# EAGLE design QuadroMIDI (EAGLE 6.6.0)
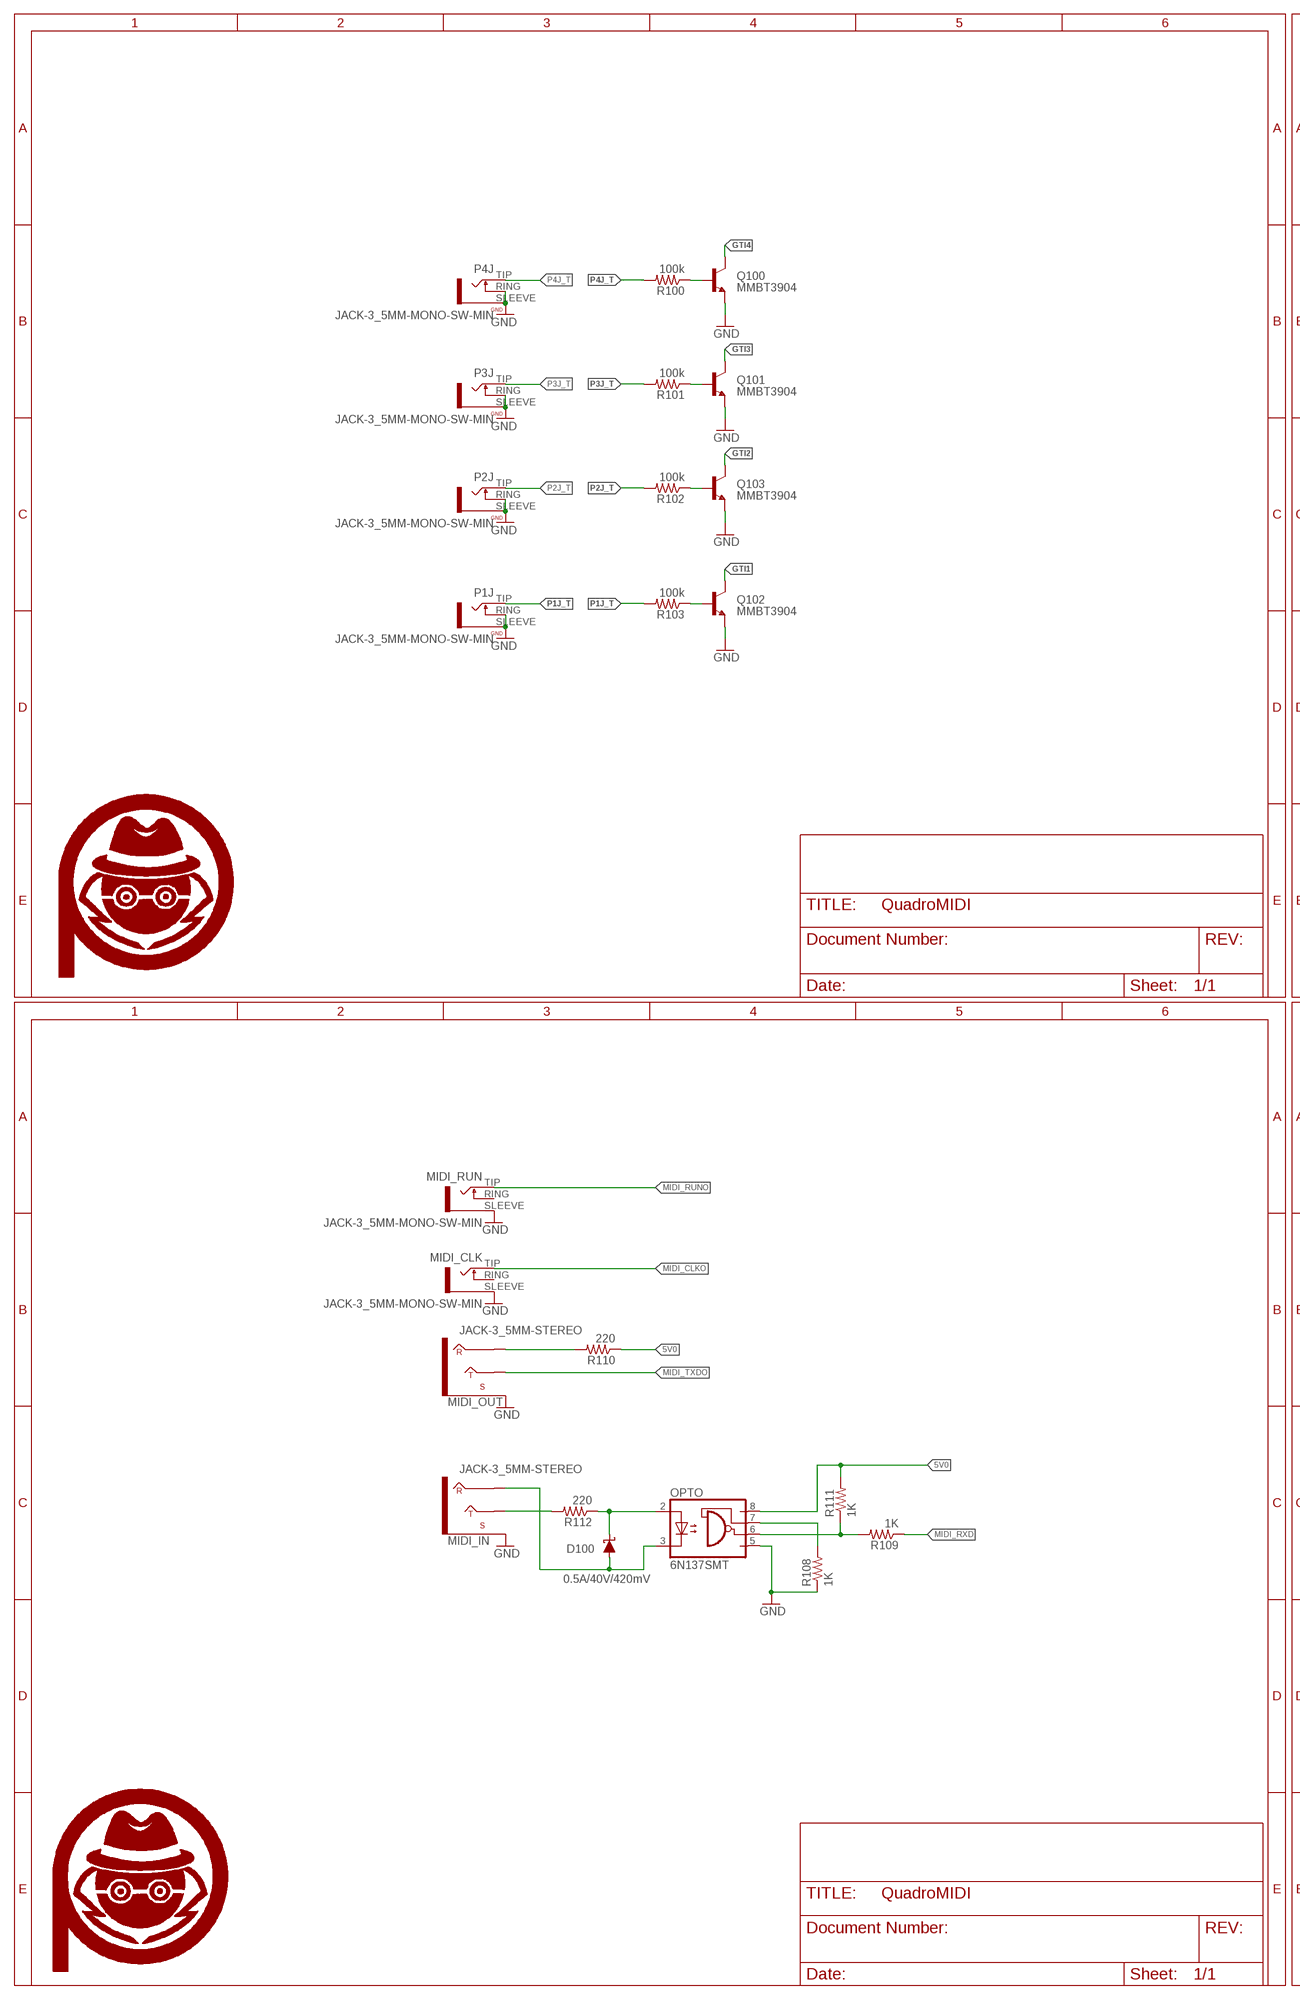
[diagram p0: schematic, sheet 1, part 1 of 2]
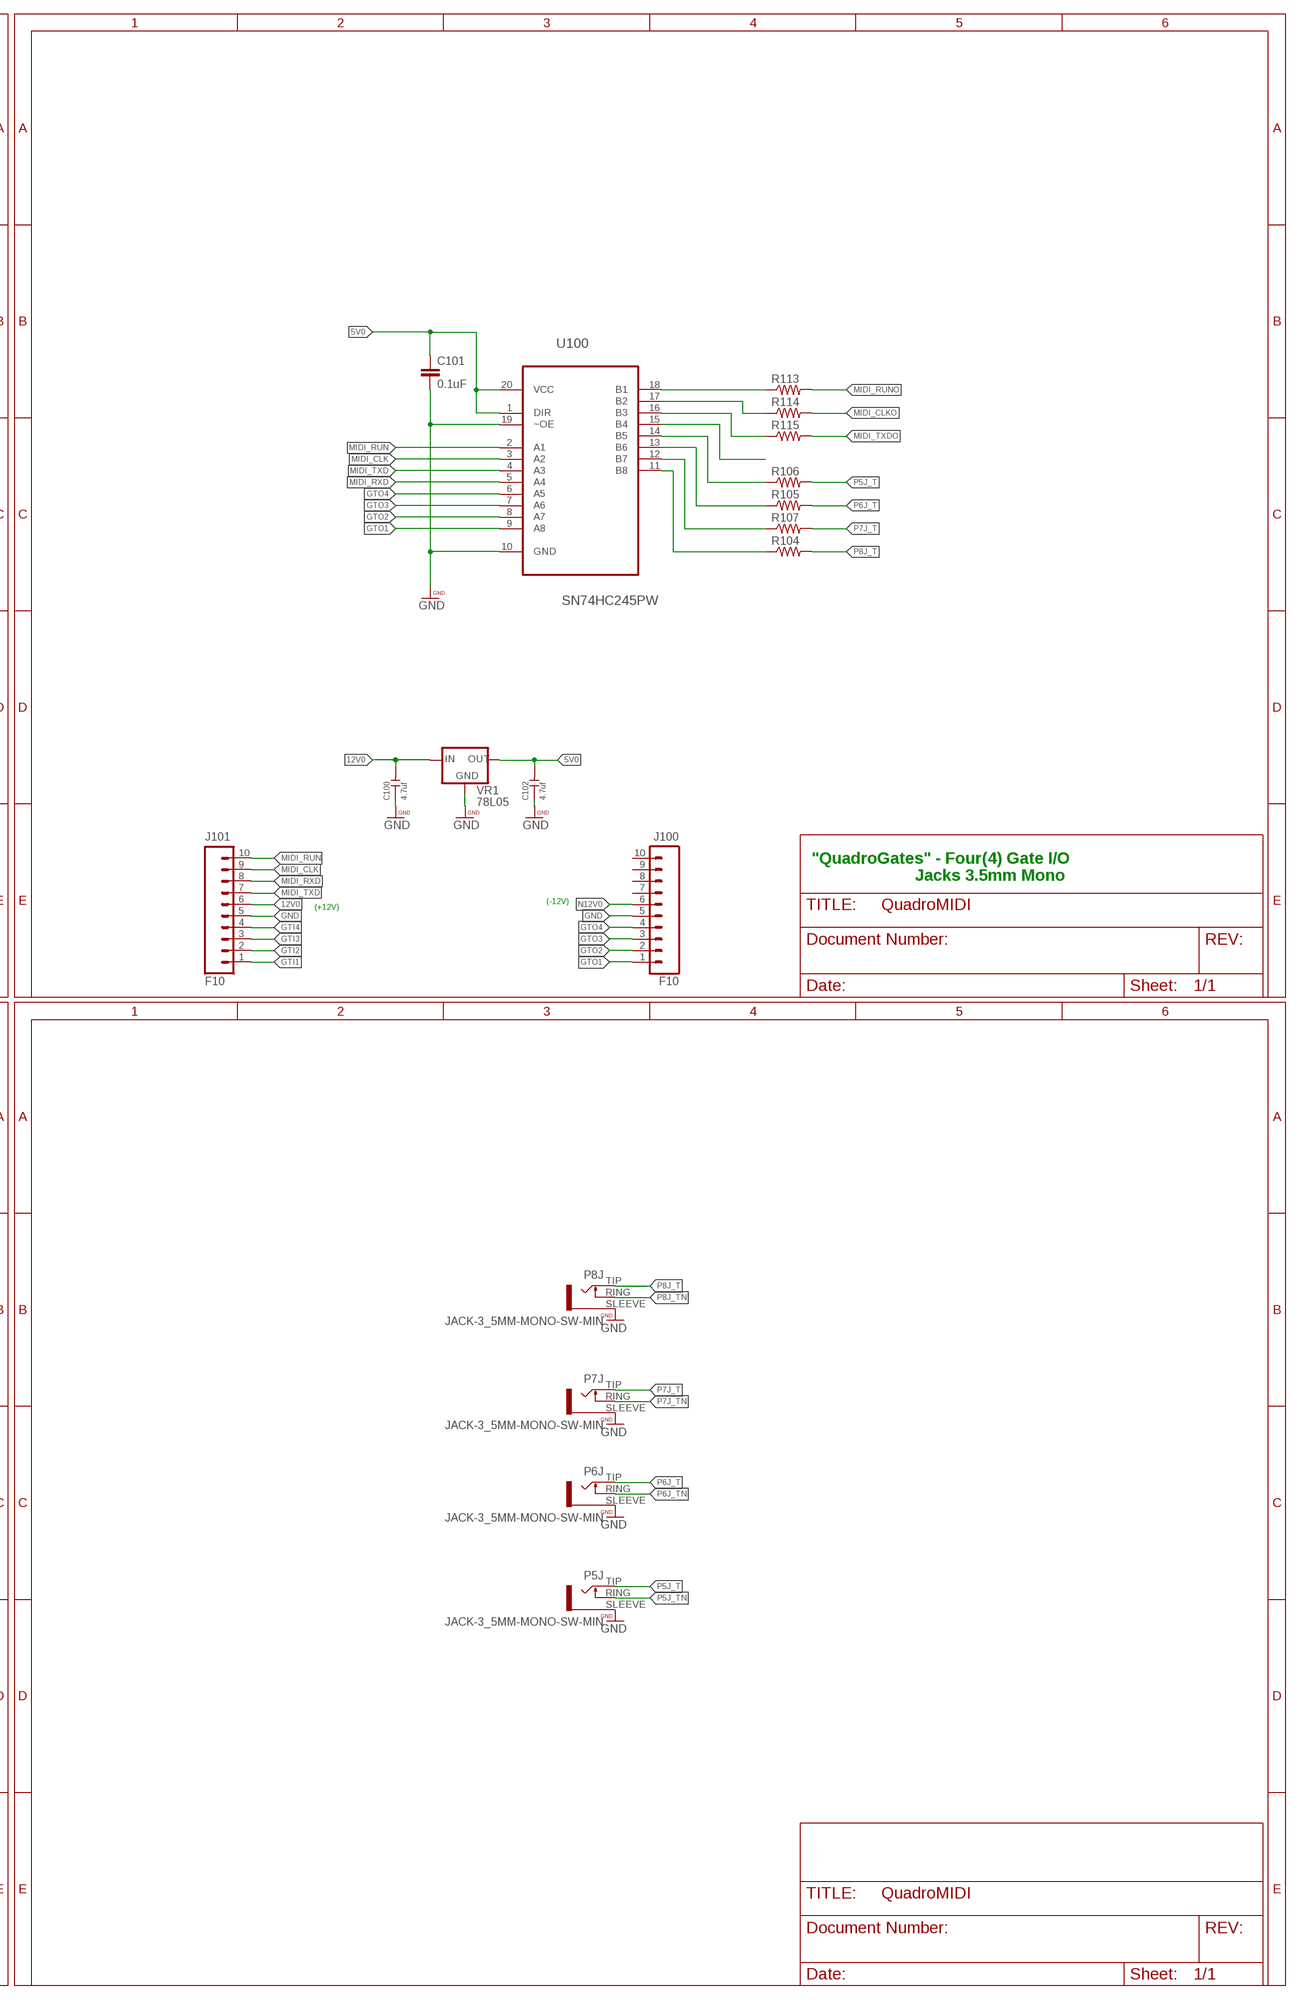
[diagram p1: schematic, sheet 1, part 2 of 2]

## Parts
$$U$1  PA_LOGO_SYMLARGE  [PA_LOGO_AGENT_LRG_SYM]
C100  4.7uf  CERAMIC-4.7UF-25V-10%-X5R(0805)  [C0805]
C101  0.1uF  CAP0603-CAP  [0603-CAP]
C102  4.7uf  CERAMIC-4.7UF-25V-10%-X5R(0805)  [C0805]
D100  0.5A/40V/420mV  DIODE-SCHOTTKY-PMEG4005EJ  [SOD-323]
J100  F10  M10SILK_FEMALE_PTH  [1X10_OCTO]
J101  F10  M10SILK_FEMALE_PTH  [1X10_OCTO]
MIDI_CLK  JACK-3_5MM-MONO-SW-MIN  [WQP_PJ301M-MIN]
MIDI_IN  JACK-3_5MM-STEREO  [WQP_PJ301M-MIN]
MIDI_OUT  JACK-3_5MM-STEREO  [WQP_PJ301M-MIN]
MIDI_RUN  JACK-3_5MM-MONO-SW-MIN  [WQP_PJ301M-MIN]
OPTO  6N137SMT  [DIL8-SMD]
P1J  JACK-3_5MM-MONO-SW-MIN  [WQP_PJ301M-MIN]
P2J  JACK-3_5MM-MONO-SW-MIN  [WQP_PJ301M-MIN]
P3J  JACK-3_5MM-MONO-SW-MIN  [WQP_PJ301M-MIN]
P4J  JACK-3_5MM-MONO-SW-MIN  [WQP_PJ301M-MIN]
P5J  JACK-3_5MM-MONO-SW-MIN  [WQP_PJ301M-MIN]
P6J  JACK-3_5MM-MONO-SW-MIN  [WQP_PJ301M-MIN]
P7J  JACK-3_5MM-MONO-SW-MIN  [WQP_PJ301M-MIN]
P8J  JACK-3_5MM-MONO-SW-MIN  [WQP_PJ301M-MIN]
Q100  MMBT3904  MMBT3904LT1-NPN-SOT23-BEC  [SOT23-BEC]
Q101  MMBT3904  MMBT3904LT1-NPN-SOT23-BEC  [SOT23-BEC]
Q102  MMBT3904  MMBT3904LT1-NPN-SOT23-BEC  [SOT23-BEC]
Q103  MMBT3904  MMBT3904LT1-NPN-SOT23-BEC  [SOT23-BEC]
R100  100k  R-US_R0603  [R0603]
R101  100k  R-US_R0603  [R0603]
R102  100k  R-US_R0603  [R0603]
R103  100k  R-US_R0603  [R0603]
R104  RESISTOR0603-RES  [0603-RES]
R105  RESISTOR0603-RES  [0603-RES]
R106  RESISTOR0603-RES  [0603-RES]
R107  RESISTOR0603-RES  [0603-RES]
R108  1K  RESISTOR0603  [0603-RES]
R109  1K  RESISTOR0603  [0603-RES]
R110  220  RESISTOR0603  [0603-RES]
R111  1K  RESISTOR0603  [0603-RES]
R112  220  RESISTOR0603  [0603-RES]
R113  RESISTOR0603-RES  [0603-RES]
R114  RESISTOR0603-RES  [0603-RES]
R115  RESISTOR0603-RES  [0603-RES]
U100  SN74HC245PW  [SOP65P640X120-20N]
U$100  PA_LOGO_SYMSMALL  [PA_LOGO_AGENT_SMALL_SYM]
VR1  78L05  78LXX-SOT89  [SOT89]

## Nets
5V0: C101.1 C102.2 OPTO.8(VCC) R110.1 R111.2 U100.1(DIR) U100.20(VCC) VR1.1(OUT)
12V0: C100.2 J101.6 VR1.3(IN)
B1: R113.1 U100.18(B1)
B2: R114.1 U100.17(B2)
B3: R115.1 U100.16(B3)
B4: U100.15(B4)
B5: R106.1 U100.14(B5)
B6: R105.1 U100.13(B6)
B7: R107.1 U100.12(B7)
B8: R104.1 U100.11(B8)
GND: C100.1 C101.2 C102.1 J100.5 J101.5 MIDI_CLK.SLEEVE MIDI_IN.SLEEVE MIDI_OUT.SLEEVE MIDI_RUN.SLEEVE OPTO.5(GND) P1J.RING(TIP_SW) P1J.SLEEVE P2J.RING(TIP_SW) P2J.SLEEVE P3J.RING(TIP_SW) P3J.SLEEVE P4J.RING(TIP_SW) P4J.SLEEVE P5J.SLEEVE P6J.SLEEVE P7J.SLEEVE P8J.SLEEVE Q100.E Q101.E Q102.E Q103.E R108.1 U100.10(GND) U100.19(~OE) VR1.2(GND)
GTI1: J101.1 Q102.C
GTI2: J101.2 Q103.C
GTI3: J101.3 Q101.C
GTI4: J101.4 Q100.C
GTO1: J100.1 U100.9(A8)
GTO2: J100.2 U100.8(A7)
GTO3: J100.3 U100.7(A6)
GTO4: J100.4 U100.6(A5)
MIDI_CLK: J101.9 U100.3(A2)
MIDI_CLKO: MIDI_CLK.TIP R114.2
MIDI_RUN: J101.10 U100.2(A1)
MIDI_RUNO: MIDI_RUN.TIP R113.2
MIDI_RXD: J101.8 R109.1 U100.5(A4)
MIDI_TXD: J101.7 U100.4(A3)
MIDI_TXDO: MIDI_OUT.TIP R115.2
MIDIP: MIDI_IN.TIP R112.2
MIDIRX: OPTO.6(VO) R109.2 R111.1
MIDN: D100.A MIDI_IN.RING OPTO.3(C)
MIDP: D100.C OPTO.2(A) R112.1
N12V0: J100.6
N$1: Q102.B R103.1
N$2: Q103.B R102.1
N$3: MIDI_OUT.RING R110.2
N$4: Q101.B R101.1
N$5: Q100.B R100.1
OPTO: OPTO.7(VE) R108.2
P1J_T: P1J.TIP R103.2
P2J_T: P2J.TIP R102.2
P3J_T: P3J.TIP R101.2
P4J_T: P4J.TIP R100.2
P5J_T: P5J.TIP R106.2
P5J_TN: P5J.RING(TIP_SW)
P6J_T: P6J.TIP R105.2
P6J_TN: P6J.RING(TIP_SW)
P7J_T: P7J.TIP R107.2
P7J_TN: P7J.RING(TIP_SW)
P8J_T: P8J.TIP R104.2
P8J_TN: P8J.RING(TIP_SW)
Unconnected: J100.7 J100.8 J100.9 J100.10 MIDI_CLK.RING(TIP_SW) MIDI_RUN.RING(TIP_SW)

## Notes on the sheet
- "QuadroGates" - Four(4) Gate I/O
                         Jacks 3.5mm Mono
- (-12V)
- (+12V)

## Library data of the parts
$$U$1 U$100 = PatternAgents-Logos:PA_LOGO_SYM: PatternAgents Logo Symbol Trademark : PatternAgents, LLC Github : https://github.com/PatternAgents/PCB_Libraries License : http://creativecommons.org/licenses/by-sa/3.0/ (Creative Commons 3.0) THIS SOFTWARE IS PROVIDED BY THE CONTRIBUTORS "AS IS" AND WITHOUT ANY EXPRESS OR IMPLIED WARRANTIES, INCLUDING, BUT NOT LIMITED TO, THE IMPLIED WARRANTIES OF MERCHANTABILITY AND FITNESS FOR A PARTICULAR PURPOSE ARE DISCLAIMED. IN NO EVENT SHALL THE COPYRIGHT OWNER OR CONTRIBUTORS BE LIABLE FOR ANY DIRECT, INDIRECT, INCIDENTAL, SPECIAL, EXEMPLARY, OR CONSEQUENTIAL DAMAGES (INCLUDING, BUT NOT LIMITED TO, PROCUREMENT OF SUBSTITUTE GOODS OR SERVICES; LOSS OF USE, DATA, OR PROFITS; OR BUSINESS INTERRUPTION) HOWEVER CAUSED AND ON ANY THEORY OF LIABILITY, WHETHER IN CONTRACT, STRICT LIABILITY, OR TORT (INCLUDING NEGLIGENCE OR OTHERWISE) ARISING IN ANY WAY OUT OF THE USE OF THIS SOFTWARE, EVEN IF ADVISED OF THE POSSIBILITY OF SUCH DAMAGE.
C100 C102 = Seeed-Capacitor-2016:CERAMIC-4.7UF-25V-10%-X5R(0805): 302010146; MPN: CC0805KKX5R8BB475
C101 = PatternAgents-Misc:CAP: Capacitor Standard 0603 ceramic capacitor, and 0.1" leaded capacitor.
D100 = SparkFun-DiscreteSemi:DIODE-SCHOTTKY: Schottky diode A Schottky diode is a semiconductor diode which has a low forward voltage drop and a very fast switching action.; PROD_ID: DIO-10955
J100 J101 = oXo_Connectors:M10: Header 10 Standard 10-pin 0.1" header. Use with straight break away headers (SKU : PRT-00116), right angle break away headers (PRT-00553), swiss pins (PRT-00743), machine pins (PRT-00117), and female headers (PRT-00115).; PROD_ID: CONN-11563
MIDI_CLK MIDI_RUN P1J P2J P3J P4J P5J P6J P7J P8J = halcyonmod_Connectors:JACK-3_5MM-MONO-SW: Jack, 3.5mm, RIght Angle, Though-Hole
MIDI_IN MIDI_OUT = halcyonmod_Connectors:JACK-3_5MM-STEREO: Stereo 3.5mm Jack (TRS - Tip, Ring, Sleeve)
OPTO = og-optocouplers:6N137: MOTOROLA OPTO COUPLER
Q100-Q103 = transistor:*-NPN-: NPN Transistror BF959 corrected 2008.03.06
R100-R103 = rcl:R-US_: RESISTOR, American symbol
R104-R115 = PatternAgents-ProtoPads:RESISTOR: Resistor Basic schematic elements and footprints for 0603, 1206, and PTH resistors.
U100 = PatternAgents-TI:SN74HC245PW: OCTAL BUS TRANSCEIVERS; MPN: SN74HC245PW; OC_FARNELL: 1236221; OC_NEWARK: 13M5213; PACKAGE: TSSOP-20; SUPPLIER: Texas Instruments
VR1 = v-reg-3:78LXX: VOLTAGE REGULATOR

## Net classes
1 power: width 0.254 mm, drill 0.356 mm, clearance 0.178 mm

## Board
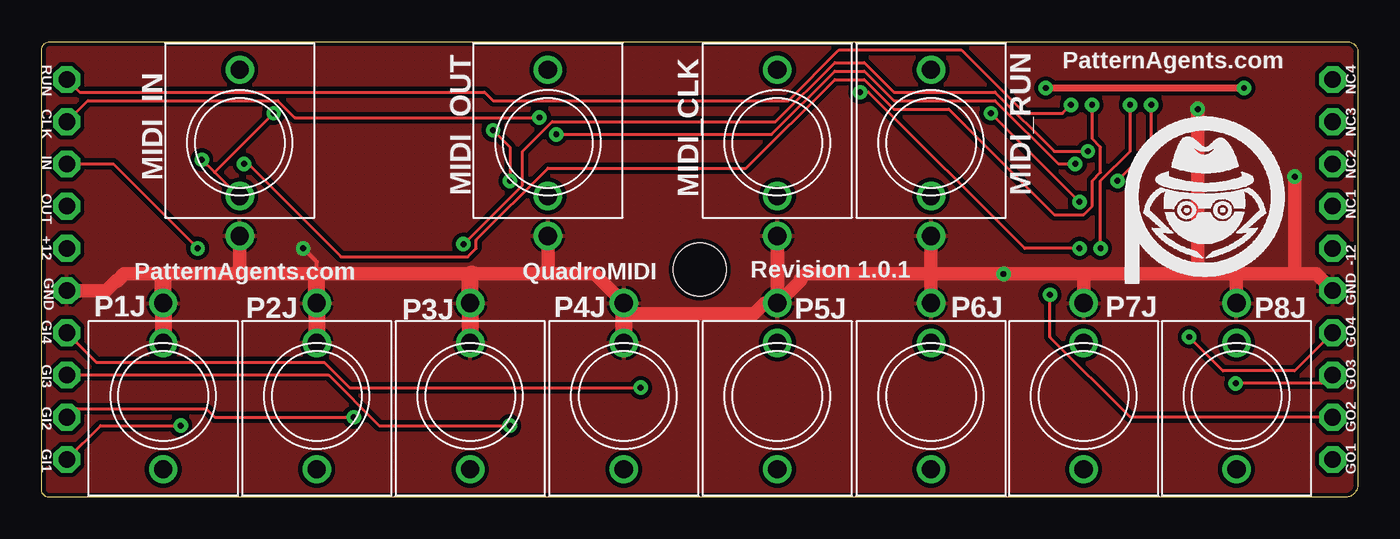
[diagram p2: board, top side]
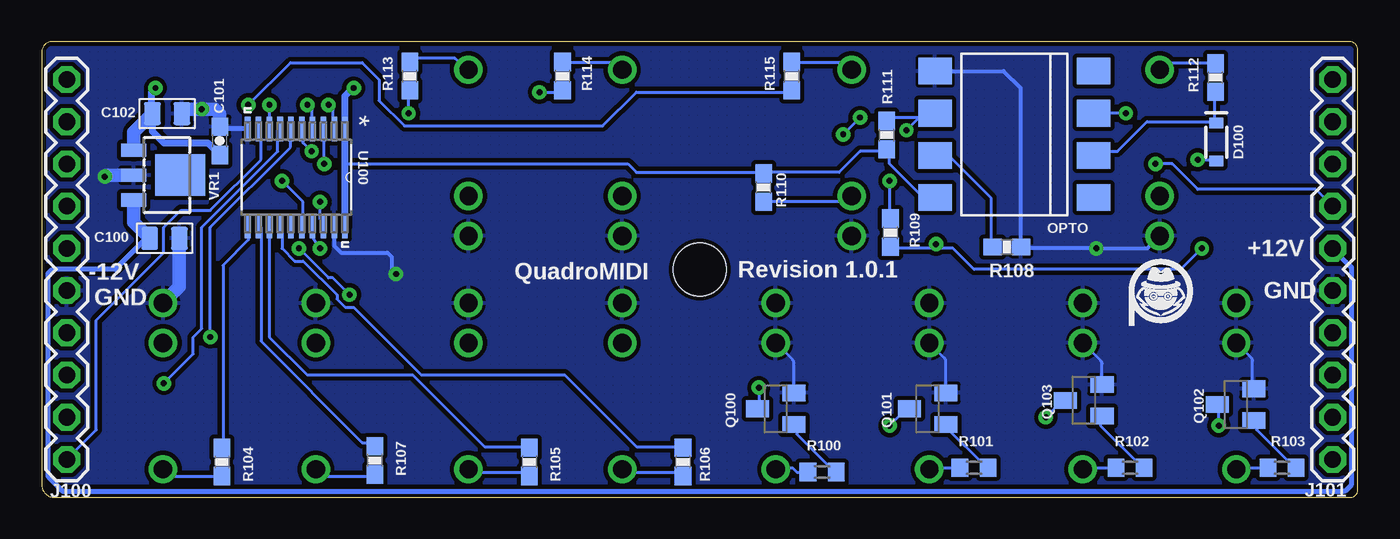
[diagram p3: board, bottom side, seen from below]

Size 79.25 x 27.43 mm. Coordinates in mm from the lower left corner, seen from the top.
Outline: 0.54,27.43 78.58,27.43 arc-90 79.25,26.76 79.25,0.79 arc-90 78.45,0 0.46,0 arc-90 0,0.46 0,26.89 arc-90 0.54,27.43
Copper layers (1*16): Top 0.035mm / dielectric 1.5mm / Bottom 0.035mm
Design rules "PatternAgents_7mil": minimum track width 7mil, minimum drill 14mil, track to track 7mil, track to pad 7mil, pad to pad 7mil, via to via 7mil, smd to smd 7mil, copper to edge 7mil, drill to drill 7mil, minimum pad ring 12mil, minimum via ring 10mil, stop-mask expansion 4mil, vias tented up to drill 25mil, thermal gap 7mil
Holes 3.2 mm at 39.62,13.72

### Footprints (pad centres in the part's own frame; a part is rotated, then mirrored left to right if it is on the bottom)
C0805 = smd 1.397 x 1.016: 1 0,0.889; 2 0,-0.889
0603-CAP = smd 1.1 x 1: 1 -0.85,0; 2 0.85,0
SOD-323 = smd 0.63 x 0.83: A 1.15,0; C -1.15,0
1X10_OCTO = drill 1 octagon: 1 0,0; 2 2.54,0; 3 5.08,0; 4 7.62,0; 5 10.16,0; 6 12.7,0; 7 15.24,0; 8 17.78,0; 9 20.32,0; 10 22.86,0
WQP_PJ301M-MIN = drill 1.1: RING 0,-3.2; SLEEVE 0,-5.6; TIP 0,4.4
DIL8-SMD = smd 1.6 x 2: 1 -3.81,-4.77; 2 -1.27,-4.77; 3 1.27,-4.77; 4 3.81,-4.77; 5 3.81,4.77; 6 1.27,4.77; 7 -1.27,4.77; 8 -3.81,4.77
SOT23-BEC = smd 1 x 1.4: B -0.95,-1.1; C 0,1.1; E 0.95,-1.1
R0603 = smd 1 x 1.1: 1 -0.85,0; 2 0.85,0
0603-RES = smd 1.1 x 1: 1 -0.85,0; 2 0.85,0
SOP65P640X120-20N = smd 1.473 x 0.356: 1 -2.921,2.921; 2 -2.921,2.286; 3 -2.921,1.626; 4 -2.921,0.965; 5 -2.921,0.33; 6 -2.921,-0.33; 7 -2.921,-0.965; 8 -2.921,-1.626; 9 -2.921,-2.286; 10 -2.921,-2.921; 11 2.921,-2.921; 12 2.921,-2.286; 13 2.921,-1.626; 14 2.921,-0.965; 15 2.921,-0.33; 16 2.921,0.33; 17 2.921,0.965; 18 2.921,1.626; 19 2.921,2.286; 20 2.921,2.921
SOT89 = smd 0.8 x 1.5: 1 -1.5,-1.75; 2 0,-1.75; 3 1.5,-1.75 | smd 2.5 x 3: 4 0,1.05

### Placement (x,y rotation side)
$$U$1  70.1,17.27 0 top
C100  71.84,15.59 270 bottom
C101  68.51,21.46 90 bottom
C102  71.69,23.1 270 bottom
D100  8.52,21.38 270 bottom
J100  77.72,2.29 90 bottom
J101  1.52,2.29 90 bottom
MIDI_CLK  44.29,21.34 0 top
MIDI_IN  11.93,21.34 0 top
MIDI_OUT  30.48,21.34 0 top
MIDI_RUN  53.54,21.34 0 top
OPTO  20.68,21.85 90 bottom
P1J  7.32,6.1 180 top
P2J  16.56,6.1 180 top
P3J  25.8,6.1 180 top
P4J  35.05,6.1 180 top
P5J  44.29,6.1 180 top
P6J  53.54,6.1 180 top
P7J  62.73,6.1 180 top
P8J  71.93,6.1 180 top
Q100  35.05,5.33 90 bottom
Q101  25.91,5.33 90 bottom
Q102  7.37,5.59 90 bottom
Q103  16.51,5.84 90 bottom
R100  32.26,1.52 180 bottom
R101  23.11,1.78 180 bottom
R102  13.72,1.78 180 bottom
R103  4.57,1.78 180 bottom
R104  68.38,2.13 270 bottom
R105  49.88,2.14 270 bottom
R106  40.63,2.14 270 bottom
R107  59.18,2.23 270 bottom
R108  21.13,15.08 180 bottom
R109  28.15,15.93 90 bottom
R110  35.78,18.65 270 bottom
R111  28.38,21.8 270 bottom
R112  8.58,25.27 90 bottom
R113  57.08,25.35 90 bottom
R114  47.88,25.35 90 bottom
R115  34.08,25.35 90 bottom
U100  63.91,19.26 270 bottom
U$100  11.88,12.08 0 bottom
VR1  71.94,19.39 270 bottom

### Tracks (layer width: path | path; a pad name or v marks a point on that pad's centre or on a via)
5V0  (via drill 0.36)
  Top 0.406: v60.45,24.64 v72.39,24.64
  Bottom 0.178: OPTO.8 25.65,18.29 26.42,18.29 28.19,20.07 28.19,20.83 R111.2 28.45,20.83 29.97,20.83 31.24,19.56 35.56,19.56 R110.1 35.81,19.56 43.43,19.56 43.94,20.07 60.98,20.07
  Bottom 0.406: C101.1 69.24,21.34 71.88,21.34 72.57,22.03 C102.2 72.64,23.17 72.64,24.38 v72.39,24.64 | U100.20 60.98,20.07 U100.1 60.98,24.15 v60.45,24.64
  Bottom 0.813: VR1.1 73.69,21.98 C102.2
12V0
  Bottom 0.305: C100.2 72.82,15.59 arc-45 73,15.52 74.8,13.72 78.51,13.72 arc-45 78.69,13.64 78.87,13.46 78.87,1.38 arc-45 78.79,1.2 77.98,0.38 0.87,0.38 arc-45 0.69,0.45 0.38,0.76 0.38,13.74 arc-45 0.46,13.92 J101.6
  Bottom 0.813: VR1.3 73.69,16.56 C100.2
B1  (via drill 0.36)
  Top 0.178: v62.48,17.78 v57.15,23.11
  Bottom 0.178: v57.15,23.11 57.15,24.38 R113.1 | v62.48,17.78 62.48,16.76 62.23,16.51 U100.18
B2  (via drill 0.36)
  Top 0.178: v49.28,24.38 49.78,24.38 59.18,14.99 v62.48,14.99
  Bottom 0.178: v49.28,24.38 48.01,24.38 R114.1 | v62.48,14.99 62.99,15.75 62.99,16.26 U100.17
B3  (via drill 0.36)
  Top 0.178: v66.8,23.62 66.8,21.08 v64.77,19.05
  Bottom 0.178: v66.8,23.62 64.26,26.16 59.94,26.16 58.93,25.15 58.93,23.88 57.4,22.35 45.47,22.35 43.43,24.38 34.29,24.38 R115.1 | v64.77,19.05 63.5,17.78 63.5,16.51 U100.16
B5
  Bottom 0.178: R106.1 40.64,3.05 43.43,3.05 47.75,7.37 56.39,7.37 60.45,11.43 60.96,11.43 61.47,11.94 61.47,12.19 63.5,14.22 64.01,14.22 64.77,14.99 64.77,16.26 U100.14
B6
  Bottom 0.178: R105.1 50.04,3.05 52.58,3.05 56.9,7.37 63.25,7.37 65.53,9.65 65.53,16.26 U100.13
B7
  Bottom 0.178: R107.1 59.44,3.3 59.94,3.3 66.04,9.4 66.04,16.26 U100.12
B8
  Bottom 0.178: R104.1 68.33,3.05 68.33,13.97 66.8,15.49 66.8,16.26 U100.11
GND  (via drill 0.36)
  Top 0.254: 16.56,13.39 16.56,14.17 v15.75,14.99
  Top 0.813: J101.5 3.88,12.45 4.48,13.05 4.58,13.05 4.98,13.45 11.68,13.45 | 11.68,13.45 25.91,13.45 30.18,13.45 | 30.18,13.45 33.3,13.45 P4J.SLEEVE 35.7,11.05 42.88,11.05 43.53,11.7 P5J.SLEEVE | P5J.SLEEVE 44.33,11.7 45.68,13.05 45.68,13.15 45.98,13.45 53.48,13.45 | 53.48,13.45 v57.91,13.45 62.48,13.45 | 62.48,13.45 69.6,13.45 | 69.6,13.45 71.98,13.45 | 71.98,13.45 75.69,13.45 | 75.69,13.45 76.72,13.45 J100.5 | P8J.SLEEVE 71.93,13.4 71.98,13.45 | P7J.SLEEVE 62.73,13.2 62.48,13.45 | P6J.SLEEVE 53.54,13.39 53.48,13.45 | MIDI_RUN.SLEEVE 53.54,13.51 53.48,13.45 | MIDI_CLK.SLEEVE P5J.SLEEVE | MIDI_OUT.SLEEVE 30.48,13.75 30.18,13.45 | MIDI_IN.SLEEVE 11.93,13.7 11.68,13.45 | v75.44,19.3 75.44,13.7 75.69,13.45 | v69.6,23.37 69.6,13.45
  Top 1.016: 7.32,13.15 P1J.SLEEVE P1J.RING | 16.56,13.39 P2J.SLEEVE P2J.RING | 25.91,13.45 25.8,13.34 P3J.SLEEVE P3J.RING | P4J.RING P4J.SLEEVE
  Bottom 0.178: P3J.SLEEVE 26.16,11.94 26.16,11.82 | OPTO.5 25.4,25.65 25.33,25.65 | 6.35,6.6 Q102.E | 6.35,6.6 6.39,6.6 | C102.1 70.61,23.62 70.67,23.62 | 6.35,6.6 6.35,8.22 arc-45 6.42,8.4 P1J.RING | Q103.E 15.41,8.04 arc-45 15.48,8.22 P2J.RING | Q101.E 24.81,8.2 arc-45 24.88,8.37 P3J.RING | Q100.E 33.95,8.09 arc-45 34.03,8.27 P4J.RING
  Bottom 0.254: U100.19 61.62,15.14 61.21,14.73 58.42,14.73 58.17,14.48 58.17,13.7 v57.91,13.45 | OPTO.5 21.34,25.66 20.32,24.64 20.32,15.11 R108.1 20.19,14.99 v15.75,14.99 12.68,14.99 MIDI_IN.SLEEVE
  Bottom 0.305: U100.10 68.38,22.18 C101.2
  Bottom 0.813: VR1.2 75.35,19.39 v75.44,19.3 | C100.1 70.95,12.68 P8J.SLEEVE | C102.1 70.53,23.37 v69.6,23.37 68.83,23.37 68.51,23.04 C101.2
  pour Bottom (isolate 0.254, hatched): 0,0 0,27.43 79.25,27.43 79.25,0
  pour Top (isolate 0.254, hatched): 0,0 0,27.43 79.25,27.43 79.25,0
GTI1  (via drill 0.36)
  Top 0.178: v8.38,4.32 3.56,4.32 J101.1
  Bottom 0.178: v8.38,4.32 8.38,5.59 Q102.C
GTI2  (via drill 0.36)
  Top 0.178: v18.8,4.83 10.41,4.83 9.91,5.33 2.03,5.33 J101.2
  Bottom 0.178: v18.8,4.83 17.78,5.84 Q103.C
GTI3  (via drill 0.36)
  Top 0.178: v28.19,4.32 20.32,4.32 17.27,7.37 J101.3
  Bottom 0.178: v28.19,4.32 27.18,5.33 Q101.C
GTI4  (via drill 0.36)
  Top 0.178: v36.07,6.6 18.54,6.6 17.02,8.13 3.3,8.13 J101.4
  Bottom 0.178: v36.07,6.6 36.07,5.33 Q100.C
GTO1
  Bottom 0.178: J100.1 75.95,4.06 75.95,10.67 71.88,14.73 71.88,16.26 70.87,17.27 69.09,17.27 66.04,20.32 66.04,22.1 U100.9
GTO2  (via drill 0.36)
  Top 0.178: v65.53,23.62 65.53,20.83 63.75,19.05 v63.75,14.99 | v60.71,12.19 60.71,9.65 65.53,4.83 J100.2
  Bottom 0.178: v65.53,23.62 65.53,22.35 U100.8 | v63.75,14.99 61.98,13.21 61.72,13.21 v60.71,12.19
GTO3  (via drill 0.36)
  Top 0.178: v71.88,6.86 77.22,6.86 J100.3
  Bottom 0.178: v71.88,6.86 70.1,8.64 70.1,9.65 69.6,10.16 69.6,16.26 65.02,20.83 65.02,22.1 U100.7
GTO4  (via drill 0.36)
  Top 0.178: v69.09,9.65 71.12,7.62 75.44,7.62 J100.4
  Bottom 0.178: v69.09,9.65 69.09,16.26 64.26,21.08 64.26,22.1 U100.6
MIDI_CLK  (via drill 0.36)
  Top 0.178: v62.23,20.07 61.21,20.07 57.4,23.88 51.31,23.88 49.53,25.65 47.75,25.65 43.94,21.84 v30.99,21.84 | v29.97,22.86 15.24,22.86 14.22,23.88 2.79,23.88 J101.9
  Bottom 0.178: v62.23,20.07 62.23,22.1 U100.3 | v29.97,22.86 v30.99,21.84
MIDI_CLKO
  Bottom 0.178: R114.2 47.75,26.16 44.7,26.16 44.45,25.91 MIDI_CLK.TIP
MIDI_RUN  (via drill 0.36)
  Top 0.178: v61.98,23.62 61.47,23.11 59.18,23.11 55.37,26.92 48.01,26.92 44.96,23.88 27.18,23.88 26.67,24.38 2.29,24.38 J101.10
  Bottom 0.178: v61.98,23.62 61.72,23.37 61.72,22.35 U100.2
MIDI_RUNO
  Bottom 0.178: R113.2 56.9,26.42 54.36,26.42 53.59,25.65 MIDI_RUN.TIP
MIDI_RXD  (via drill 0.36)
  Top 0.178: v9.4,14.99 4.32,20.07 J101.8 | v62.99,20.83 60.96,20.83 57.4,24.38 51.31,24.38 49.53,26.16 47.75,26.16 44.2,22.61 30.73,22.61 28.96,20.83 28.96,18.8 v25.4,15.24
  Bottom 0.178: 25.4,14.99 24.38,14.99 23.11,13.72 10.67,13.72 v9.4,14.99 | 25.4,14.99 27.94,14.99 R109.1 | v62.99,20.83 63.5,21.34 63.5,22.1 U100.5 | 25.4,14.99 v25.4,15.24
MIDI_TXD  (via drill 0.36)
  Top 0.178: v63.25,23.62 63.25,21.59 63.75,21.08 63.75,19.56 63.25,19.05 63.25,17.53 62.74,17.02 60.96,17.02 54.61,23.37 51.31,23.37 49.53,25.15 47.75,25.15 42.42,19.81 30.48,19.81 26.16,15.49 26.16,14.99 25.65,14.48 18.03,14.48 12.45,20.07 v12.19,20.07
  Bottom 0.178: v63.25,23.62 62.99,23.37 62.99,22.35 U100.4 | v12.19,20.07 11.18,20.07 9.65,18.54 2.54,18.54 J101.7
MIDI_TXDO
  Bottom 0.178: R115.2 34.04,26.16 30.99,26.16 30.73,25.91 MIDI_OUT.TIP
MIDIP
  Bottom 0.178: R112.2 8.64,26.16 11.43,26.16 11.68,25.91 MIDI_IN.TIP
MIDIRX  (via drill 0.36)
  Top 0.178: v28.19,19.05 28.19,21.08 v27.18,22.1
  Bottom 0.178: v28.19,19.05 28.19,17.02 R109.2 | 26.42,22.86 26.16,23.11 25.65,23.11 OPTO.6 26.42,22.86 | 26.42,22.86 v27.18,22.1 | 26.42,22.86 28.19,22.86 R111.1
MIDN  (via drill 0.36)
  Top 0.178: 10.41,19.56 11.68,18.29 MIDI_IN.RING | 10.41,19.56 v9.65,20.32 | 10.41,19.56 v13.97,23.11
  Bottom 0.178: v9.65,20.32 8.64,20.32 D100.A | v13.97,23.11 15.75,23.11 OPTO.3
MIDP
  Bottom 0.178: 8.64,22.61 8.64,24.38 R112.1 | 8.64,22.61 12.7,22.61 14.48,20.83 15.75,20.83 OPTO.2 | 8.64,22.61 D100.C
N$1
  Bottom 0.178: R103.1 3.81,1.78 6.1,4.06 6.1,4.57 Q102.B
N$2
  Bottom 0.178: R102.1 12.95,1.78 15.49,4.32 15.49,4.83 Q103.B
N$3
  Bottom 0.178: R110.2 35.56,17.78 30.99,17.78 30.73,18.03 MIDI_OUT.RING
N$4
  Bottom 0.178: R101.1 22.35,1.78 24.89,4.32 Q101.B
N$5
  Bottom 0.178: R100.1 31.5,1.52 33.78,3.81 33.78,4.32 Q100.B
OPTO
  Bottom 0.178: R108.2 22.1,15.24 22.1,18.03 24.64,20.57 25.4,20.57 OPTO.7
P1J_T
  Bottom 0.178: R103.2 7.11,1.78 P1J.TIP
P2J_T
  Bottom 0.178: R102.2 16.51,1.78 P2J.TIP
P3J_T
  Bottom 0.178: R101.2 25.65,1.78 P3J.TIP
P4J_T
  Bottom 0.178: R100.2 33.78,1.52 34.04,1.78 35.05,1.78 P4J.TIP
P5J_T
  Bottom 0.178: R106.2 40.64,1.52 44.2,1.52 P5J.TIP
P6J_T
  Bottom 0.178: R105.2 50.04,1.52 53.34,1.52 P6J.TIP
P7J_T
  Bottom 0.178: R107.2 59.44,1.27 62.23,1.27 62.48,1.52 P7J.TIP
P8J_T
  Bottom 0.178: R104.2 68.58,1.27 71.63,1.27 71.88,1.52 P8J.TIP

### Text on the board
tPlace: RUN | PatternAgents.com | NC4 | CLK | NC3 | IN | OUT | NC2 | NC1 | +12 | -12 | GND | PatternAgents.com | QuadroMIDI | Revision 1.0.1 | GND | GI4 | GO4 | GI3 | GO3 | GI2 | GO2 | GI1 | GO1
bPlace: +12V | Revision 1.0.1 | QuadroMIDI | -12V | GND | GND